# Altium schematic sheet AC-DC_Converter_Wiring.SchDoc
size Letter; DocumentNumber: 1; SheetNumber: 1; SheetTotal: 1
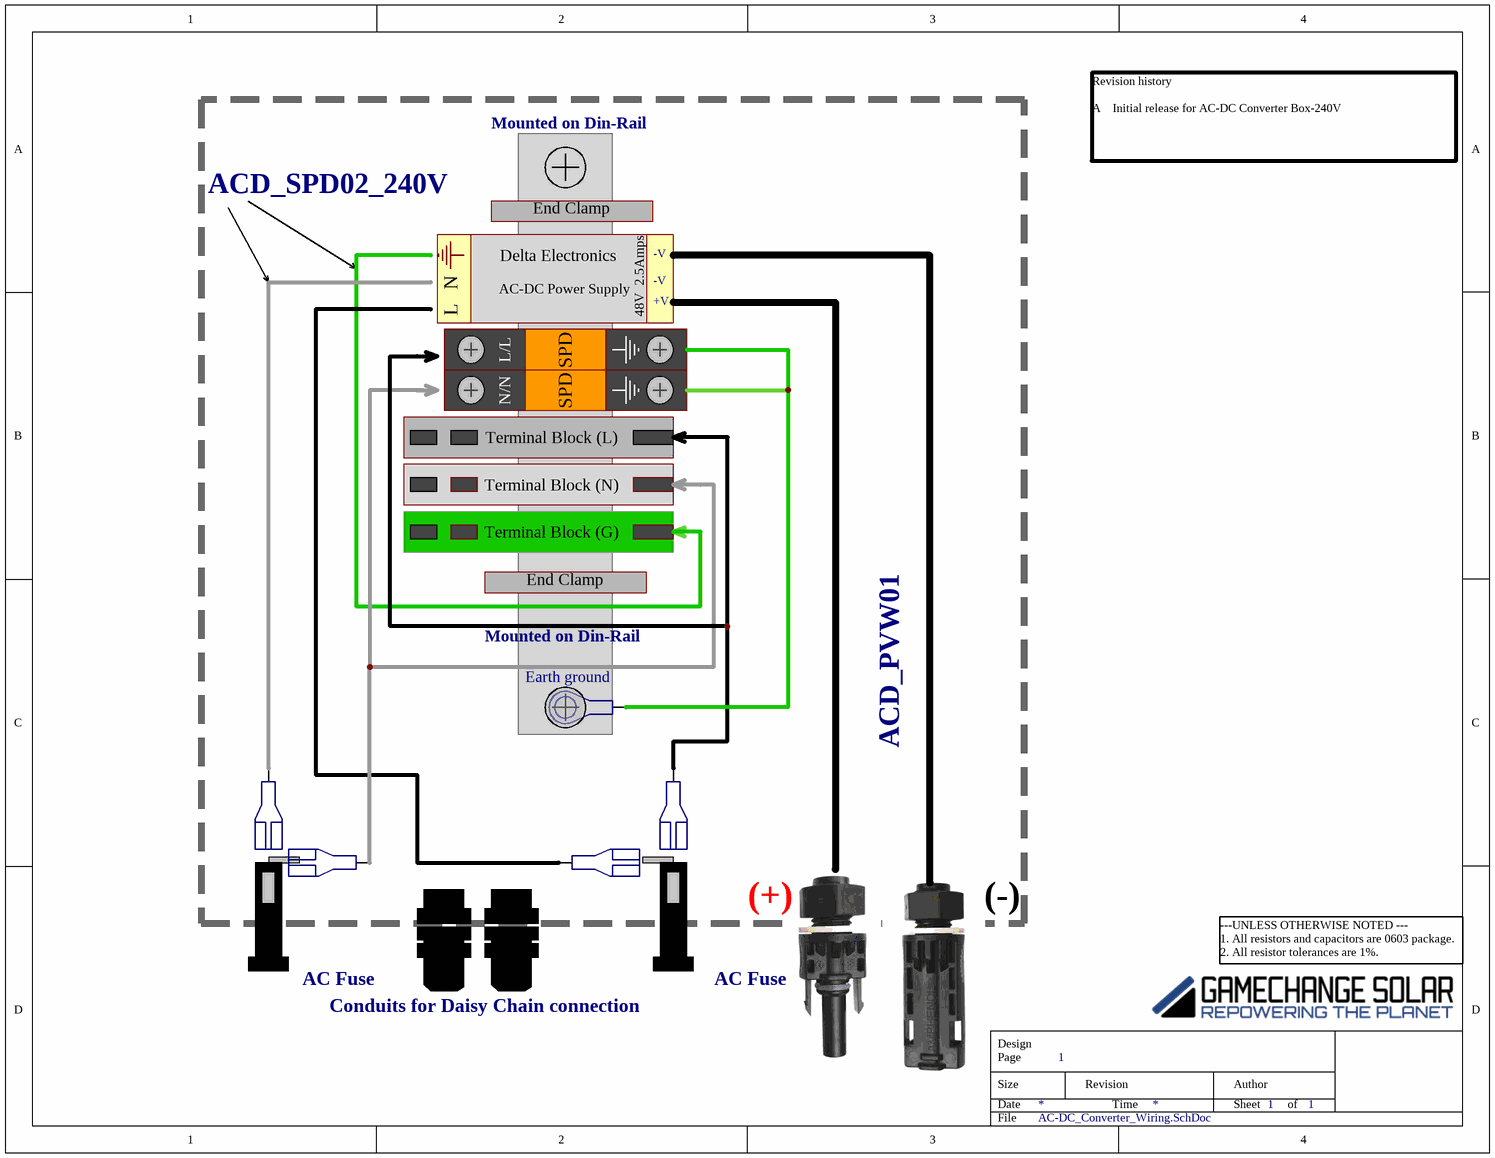
[diagram p0: AC-DC_Converter_Wiring.SchDoc]

## Parts
(Parts that share a designator on the sheet are numbered #1, #2 ... from top to bottom, then left to right.)
J?#1  Ring terminal  (value not drawn)
J?#2  F2 terminal  (value not drawn)
J?#3  F2 terminal  (value not drawn)
J?#4  F2 terminal  (value not drawn)
J?#5  F2 terminal  (value not drawn)

## Nets

Not connected (* = marked no-connect by the designer): J?#1 1(X); J?#2 1(X); J?#3 1(X); J?#4 1(X); J?#5 1(X)

## Notes on the sheet
- Mounted on Din-Rail
- Revision history
  A    Initial release for AC-DC Converter Box-240V
- ACD_SPD02_240V
- End Clamp
- N
- Delta Electronics
- AC-DC Power Supply
- 48V  2.5Amps
- -V
- L
- L/L
- SPD
- +V
- N/N
- Terminal Block (L)
- Terminal Block (N)
- Terminal Block (G)
- (near J?#1) Earth ground
- ACD_PVW01
- (+)
- (-)
- AC Fuse
- Conduits for Daisy Chain connection
- Labels drawn without touching a wire or pin: GND
- ---UNLESS OTHERWISE NOTED ---
  1. All resistors and capacitors are 0603 package.
  2. All resistor tolerances are 1%.
- Design
- Size
- Date
- Page
- Revision
- Time
- Sheet
- Author
- of
- File

## Library data of the parts
J?#1 = Ring terminal: Manufacturer: TE Connectivity; Order code: 130046; Alternative source: Phoenix 3240020; Package: 20-16AWG; Supplier info: Digikey 277-11121-ND
J?#2-J?#5 = Faston female: Female, insulated, UL 310; Manufacturer: TE Connectivity; Order code: 2-520183-2; Package: 22-18AWG, 0.25" x 0.032"; Supplier info: DigiKey A27817CT-ND